# Altium schematic sheet iSystem-jumpers.SchDoc
size A4; SheetNumber: 3; SheetTotal: 8
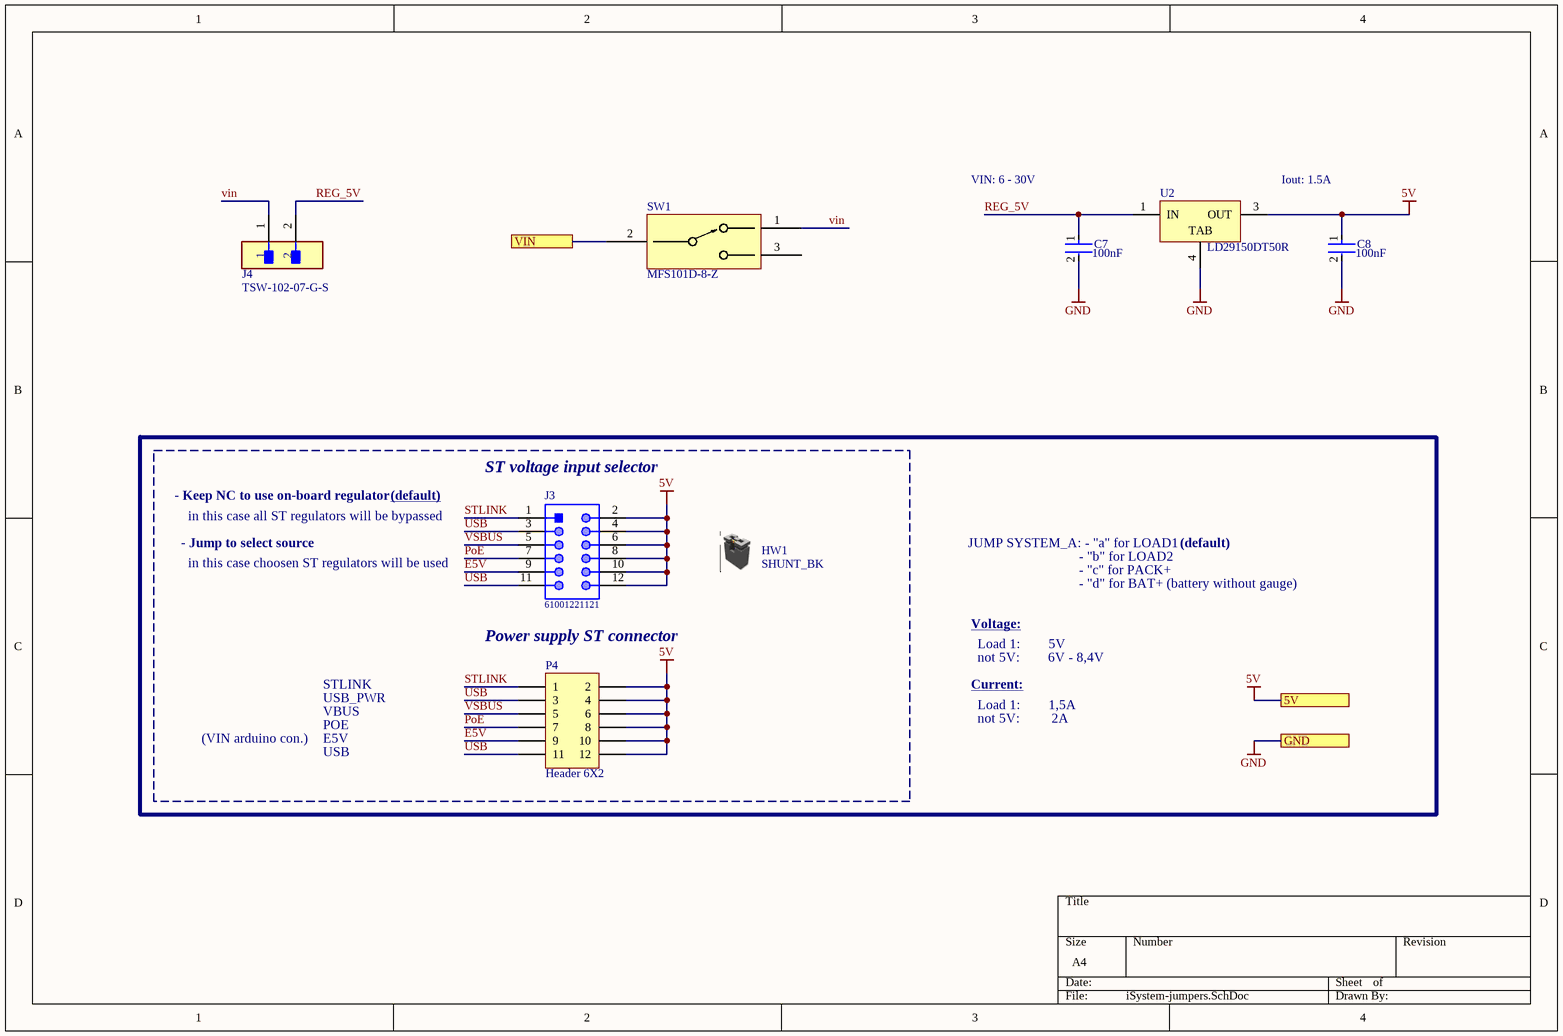
[diagram p0: iSystem-jumpers.SchDoc]

## Parts
C7  100nF  [FP-CGA3E-0_3-0_1-IPC_A]
C8  100nF  [FP-CGA3E-0_3-0_1-IPC_A]
HW1  value SHUNT_BK  [NA]  (hidden comment: Shunt Black 2.54mm)  (mechanical)
J3  61001221121  [61001221121]
J4  TSW-102-07-G-S  [FP-TSW-102-07-G-S-MFG]
P4  Header 6X2  [HDR2X6]
SW1  MFS101D-8-Z  [MFS101D-8-Z]
U2  LD29150DT50R  [TO-252_M]

## Ports
5V, GND, VIN

## Nets
5V: C8.1 J3.2 J3.4 J3.6 J3.8 J3.10 J3.12 P4.2 P4.4 P4.6 P4.8 P4.10 P4.12 U2.3(OUT) ; port 5V
GND: C7.2 C8.2 U2.4(TAB) ; port GND
E5V: J3.9 P4.9
PoE: J3.7 P4.7
REG_5V: C7.1 J4.2 U2.1(IN)
STLINK: J3.1 P4.1
USB: J3.3 J3.11 P4.3 P4.11
vin: J4.1 SW1.1
VIN: SW1.2 ; port VIN  [a separate net that carries the same name]
VSBUS: J3.5 P4.5

Not connected (* = marked no-connect by the designer): SW1 3

## Notes on the sheet
- VIN: 6 - 30V
- Iout: 1.5A
- - Keep NC to use on-board regulator
- (near J3) in this case all ST regulators will be bypassed
- (default)
- ST voltage input selector
- - Jump to select source
- (near J3) in this case choosen ST regulators will be used
- JUMP SYSTEM_A: - "a" for LOAD1
- - "b" for LOAD2
- - "c" for PACK+
- Power supply ST connector
- Voltage:
- Load 1:        5V
- - "d" for BAT+ (battery without gauge)
- STLINK
- USB_PWR
- VBUS
- Current:
- not 5V:        6V - 8,4V
- Load 1:        1,5A
- (VIN arduino con.)
- POE
- E5V
- USB
- not 5V:         2A

## Library data of the parts
C7 C8 = CMP-2000-07546-2: Cap Ceramic 100nF 50V X7R 10% Pad SMD 0603 +125°C Automotive T/R; Weight: 7.1E-05oz; Composition: Ceramic; Max Operating Temperature: 125°C; Termination: SMD/SMT; Dielectric: X7R; Length: 1.6mm; Package Quantity: 1; REACH SVHC: No SVHC; Lead Free: Lead Free; Case Code (Metric): 1608; Min Operating Temperature: -55°C; Packaging: Tape and Reel; Tolerance: 10%; Voltage Rating: 50V; Case Code (Imperial): 0603; Capacitance: 100nF; Case/Package: 0603; Voltage Rating (DC): 50V; Depth: 0.8mm; Radiation Hardening: No; Ratings: AEC-Q200; Mount: Surface Mount; Voltage: 50V; Thickness: 0.035inch; Width: 0.8mm; Height: 0.8mm
HW1 = MCD-00122: SHUNT, 2.54mm, height 6.10mm, BLACK; Manufacturer_Part_Number: SNT-100-BK-G; Manufacturer: SAMTEC; Part_Type: Connector; ECCN_US: EAR99; ECCN_EU: NEC; Provided_By: Subcon; Initial_Board_Reference: mb1262; Internal_Part_Number: MCD-00122; Status: Released; ComponentLink1Description: Samtec_Shunt_Jumper_SNT100.pdf; ComponentLink1URL: http://tunmcdsvn.tun.st.com/Component_Datasheet_Library/Trunk/Connectors/Samtec_Shunt_Jumper_SNT100.pdf
J3 = CMP-1502-01029-1: SMT Vertical Pin Header WR-PHD, Pitch 2.54 mm, Dual Row, 12 pins; Manufacturer: Wurth Elektronik; Working Voltage: 250VAC; Pin Number: 12; Withstanding Voltage: 500VAC; Contact Resistance: 20mOhm; Rated Current: 3A; Gender: Male; Pitch: 2.54mm; Publisher: WurthElektronik; Packaging: Tube; Part Number: 61001221121; Row Number: Dual; Mounting Technology: SMT; Manufacturer URL: http://www.we-online.de; Operating Temperature: -40to125degC; Datasheet URL: https://katalog.we-online.de/em/datasheet/6100xx21121.pdf; Orientation: Vertical; Package Reference: 61001221121
J4 = CMP-02766-000084-1: CONN HEADER VERT 2POS 2.54MM; Manufacturer: Samtec; Number Of Contacts: 2; Voltage Rating: 550V; Conn Orientation: Straight; Current Rating: 6.3A; Conn Gender: Male; Package: TSW-102-07-G-S; Digikey Description: CONN HEADER VERT 2POS 2.54MM; ComponentLink2URL: http://suddendocs.samtec.com/catalog_english/tsw_th.pdf; Height: 8.71mm; Temperature: -55°C to +125°C; Device Class L2: Headers and Wire Housings; ComponentLink2Description: Datasheet; Device Class L3: unset; Contact Material: Gold,Nickel; Temperature Range Low: -55°C; Temperature Range High: +125°C; RoHS: TRUE; Device Class L1: Connectors; Mouser Description: Conn Unshrouded Header HDR 2 POS 2.54mm Solder ST Thru-Hole Automotive Bulk; Number Of Rows: 1; Category: Conn; Pitch: 2.54mm; Lead Free: Yes; Automotive: No; Manufacturer Part Number: TSW-102-07-G-S; Footprint Url: http://suddendocs.samtec.com/prints/tsw-xxx-xx-x-x-xx-xxx-footprint.pdf; Octopart: https://octopart.com/tsw-102-07-g-s-samtec-272197
P4 = Header 6X2: Header, 6-Pin, Dual row; LatestRevisionDate: 17-Jul-2002; LatestRevisionNote: Re-released for DXP Platform.; Publisher: Altium Limited
U2 = CMP-0244-00134-1: 1.5A, Very-Low Drop Voltage Regulator, 5V, 3-Pin DPAK; PackageDescription: 3-Pin Transistor Outline Package 2.28 mm Pitch, 9.7 mm Lead Span (DPAK); ComponentLink1URL: http://www.st.com; PackageVersion: 2011; ComponentLink1Description: Manufacturer URL; DatasheetVersion: 27/10/2010; ComponentLink2URL: http://www.st.com/internet/com/TECHNICAL_RESOURCES/TECHNICAL_LITERATURE/DATASHEET/CD00003403.pdf; PackageReference: TO-252; ComponentLink2Description: Datasheet